# Altium project 230228_FIrst_Project.PrjPcb
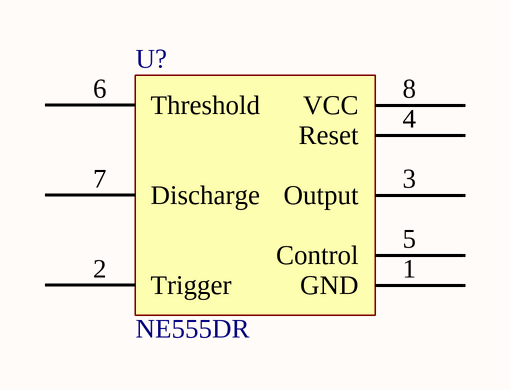
[diagram p0: 555 Timer.SchDoc]
1 sheet, 1 parts. Net scope: global (net labels, ports and power ports of the same name join across sheets).
Board file: 555 Timer.PcbDoc

## Sheet 555 Timer.SchDoc
size A4; SheetNumber: 1; SheetTotal: 1

### Parts
U?  NE555DR  [SOIC-8]

### Nets

Not connected (* = marked no-connect by the designer): U? 1(GND) 2(Trigger) 3(Output) 4(Reset) 5(Control) 6(Threshold) 7(Discharge) 8(VCC)

### Library data of the parts
U? = NE555DR: Manufacturer: TI; Workshop Stock: 10; Part Number: NE555DR; Mouser Part Number: 595-NE555DR; Mouser Link: https://au.mouser.com/ProductDetail/Texas-Instruments/NE555DR?qs=gb35HGp1gQJ5U8ZthvvoVQ%3D%3D; Digikey Part Number: 296-6501-1-ND; Digikey Link: https://www.digikey.com.au/en/products/detail/texas-instruments/NE555DR/372491